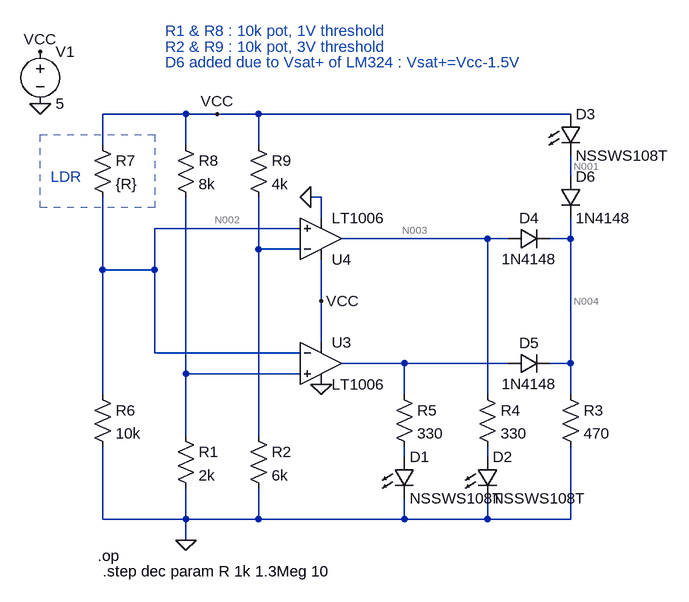
[diagram p0: schematic LDR archi.asc]
LDR archi.asc, the LTspice schematic file:
Version 4
SHEET 1 920 680
WIRE 176 -80 48 -80
WIRE 224 -80 176 -80
WIRE 288 -80 224 -80
WIRE 768 -80 288 -80
WIRE 48 -32 48 -80
WIRE 176 -32 176 -80
WIRE 288 -32 288 -80
WIRE 768 16 768 -16
WIRE 384 48 368 48
WIRE 384 80 384 48
WIRE 352 96 128 96
WIRE 640 112 416 112
WIRE 672 112 640 112
WIRE 768 112 768 80
WIRE 768 112 736 112
WIRE 288 128 288 48
WIRE 352 128 288 128
WIRE 48 160 48 48
WIRE 128 160 128 96
WIRE 128 160 48 160
WIRE 384 208 384 144
WIRE 384 272 384 208
WIRE 128 288 128 160
WIRE 352 288 128 288
WIRE 512 304 416 304
WIRE 672 304 512 304
WIRE 768 304 768 112
WIRE 768 304 736 304
WIRE 176 320 176 48
WIRE 352 320 176 320
WIRE 48 352 48 160
WIRE 512 352 512 304
WIRE 640 352 640 112
WIRE 768 352 768 304
WIRE 176 416 176 320
WIRE 288 416 288 128
WIRE 512 448 512 432
WIRE 640 448 640 432
WIRE 48 544 48 432
WIRE 176 544 176 496
WIRE 176 544 48 544
WIRE 288 544 288 496
WIRE 288 544 176 544
WIRE 512 544 512 512
WIRE 512 544 288 544
WIRE 640 544 640 512
WIRE 640 544 512 544
WIRE 768 544 768 432
WIRE 768 544 640 544
WIRE 176 576 176 544
FLAG -48 -96 0
FLAG -48 -176 VCC
FLAG 384 208 VCC
FLAG 224 -80 VCC
FLAG 384 336 0
FLAG 176 576 0
FLAG 368 48 0
SYMBOL voltage -48 -192 R0
WINDOW 123 0 0 Left 2
WINDOW 39 0 0 Left 2
SYMATTR InstName V1
SYMATTR Value 5
SYMBOL res 160 400 R0
SYMATTR InstName R1
SYMATTR Value 2k
SYMBOL res 272 400 R0
SYMATTR InstName R2
SYMATTR Value 6k
SYMBOL LED 752 -80 R0
SYMATTR InstName D3
SYMATTR Value NSSWS108T
SYMBOL res 752 336 R0
SYMATTR InstName R3
SYMATTR Value 470
SYMBOL res 624 336 R0
SYMATTR InstName R4
SYMATTR Value 330
SYMBOL res 496 336 R0
SYMATTR InstName R5
SYMATTR Value 330
SYMBOL diode 672 128 R270
WINDOW 0 32 32 VTop 2
WINDOW 3 0 32 VBottom 2
SYMATTR InstName D4
SYMATTR Value 1N4148
SYMBOL diode 672 320 R270
WINDOW 0 32 32 VTop 2
WINDOW 3 0 32 VBottom 2
SYMATTR InstName D5
SYMATTR Value 1N4148
SYMBOL res 32 336 R0
SYMATTR InstName R6
SYMATTR Value 10k
SYMBOL res 32 -48 R0
SYMATTR InstName R7
SYMATTR Value {R}
SYMBOL Opamps\\LT1006 384 240 R0
SYMATTR InstName U3
SYMBOL Opamps\\LT1006 384 176 M180
SYMATTR InstName U4
SYMBOL res 160 -48 R0
SYMATTR InstName R8
SYMATTR Value 8k
SYMBOL res 272 -48 R0
SYMATTR InstName R9
SYMATTR Value 4k
SYMBOL diode 752 16 R0
SYMATTR InstName D6
SYMATTR Value 1N4148
SYMBOL LED 496 448 R0
SYMATTR InstName D1
SYMATTR Value NSSWS108T
SYMBOL LED 624 448 R0
SYMATTR InstName D2
SYMATTR Value NSSWS108T
TEXT 40 600 Left 2 !.op
TEXT 48 624 Left 2 !.step dec param R 1k 1.3Meg 10
TEXT -32 16 Left 2 ;LDR
TEXT 144 -208 Left 2 ;R1 & R8 : 10k pot, 1V threshold
TEXT 144 -184 Left 2 ;R2 & R9 : 10k pot, 3V threshold
TEXT 144 -160 Left 2 ;D6 added due to Vsat+ of LM324 : Vsat+=Vcc-1.5V
RECTANGLE Normal 128 64 -48 -48 2

The netlist it stands for:
* LDR archi.asc
V1 VCC 0 5
R1 N007 0 2k
R2 N005 0 6k
D3 VCC N001 NSSWS108T
R3 N004 0 470
R4 N003 N009 330
R5 N006 N008 330
D4 N003 N004 1N4148
D5 N006 N004 1N4148
R6 N002 0 10k
R7 VCC N002 {R}
XU3 N007 N002 VCC 0 N006 LT1006  ; pins In+ In- V+ V- OUT
XU4 N002 N005 VCC 0 N003 LT1006  ; pins In+ In- V+ V- OUT
R8 VCC N007 8k
R9 VCC N005 4k
D6 N001 N004 1N4148
D1 N008 0 NSSWS108T
D2 N009 0 NSSWS108T
.model D D
.lib standard.dio
.op
.step dec param R 1k 1.3Meg 10
* LDR
* R1 & R8 : 10k pot, 1V threshold
* R2 & R9 : 10k pot, 3V threshold
* D6 added due to Vsat+ of LM324 : Vsat+=Vcc-1.5V
.lib LTC.lib
.backanno
.end

* Results of the author's LTspice run, read from the files saved beside the schematic
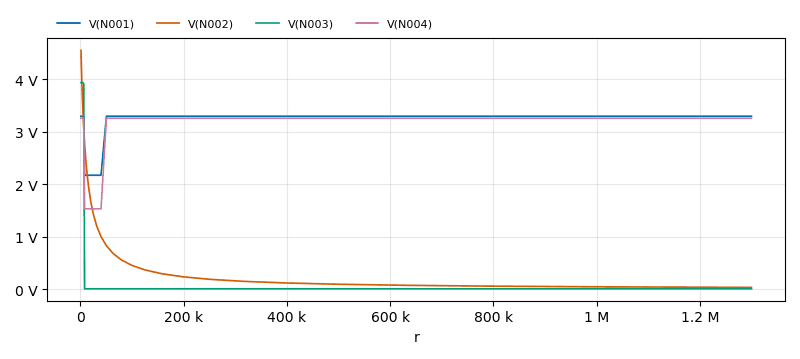
[diagram p1: Operating Point of LDR archi.asc, plotted from the saved traces]
* Operating Point, 1 run:
*   V(N001): 3.294 V at r=1 k, 3.294 V at r=1.3 M, min 2.171 V, max 3.294 V
*   V(N002): 4.545 V at r=1 k, 38.44 mV at r=1.3 M, min 38.44 mV, max 4.545 V
*   V(N003): 3.931 V at r=1 k, 11.86 mV at r=1.3 M, min 11.86 mV, max 3.931 V
*   V(N004): 3.255 V at r=1 k, 3.255 V at r=1.3 M, min 1.531 V, max 3.255 V
* From the log:
*   Semiconductor Device Operating Points:
*                           --- Diodes ---
*   Name:    d:u4:6      d:u4:1      d:u4:5      d:u4:4      d:u4:3
*   Model:    u4:yd       u4:yu       u4:xd       u4:xu     u4:dbias
*   Id:     -1.04e-12    1.04e-12   -9.35e-11    1.38e-05   -8.80e-09
*   Vd:     -5.20e-01    5.20e-01   -4.45e+00   -5.49e-01   -2.00e+00
*   Req:     1.00e-12    1.00e-12    2.00e-11    1.00e-03    1.00e+12
*   CAP:     0.00e+00    0.00e+00    0.00e+00    0.00e+00    0.00e+00
*   Name:    d:u4:2      d:u3:6      d:u3:1      d:u3:5      d:u3:4
*   Model:  u4:dbias      u3:yd       u3:yu       u3:xd       u3:xu
*   Id:     -8.80e-09    1.13e-13   -1.13e-13    1.38e-05   -1.06e-10
*   Vd:     -4.55e-01    5.64e-02   -5.64e-02    4.45e-02   -5.04e+00
*   Req:     3.71e+10    1.00e-12    1.00e-12    1.00e-03    2.00e-11
*   CAP:     0.00e+00    0.00e+00    0.00e+00    0.00e+00    0.00e+00
*   Name:    d:u3:3      d:u3:2        d6          d5          d4
*   Model:  u3:dbias    u3:dbias     1n4148      1n4148      1n4148
*   Id:     -8.80e-09   -8.80e-09    3.46e-09   -2.52e-09    6.93e-03
*   Vd:     -4.55e-01   -4.00e+00    3.92e-02   -3.24e+00    6.76e-01
*   Req:     3.71e+10    1.00e+12    7.58e+06    1.00e+12    6.54e+00
*   CAP:     0.00e+00    0.00e+00    4.07e-12    2.24e-12    3.06e-09
*   Name:      d2          d1          d3
*   Model:  nssws108t   nssws108t   nssws108t
*   Id:      3.33e-03    1.19e-14    3.46e-09
*   Vd:      2.83e+00    1.19e-02    1.71e+00
*   Req:     2.35e+01    1.00e+12    2.26e+07
*   CAP:     1.95e-10    4.23e-11    1.31e-10
*                           --- VDMOSFET Transistors ---
*   Name:        m:u4:2      m:u4:1      m:u3:2      m:u3:1
*   Model:        u4:p        u4:n        u3:p        u3:n
*   Id:         -3.94e-12    1.03e-02   -1.01e-04    1.01e-04
*   Vgs:         5.20e-01    5.20e-01   -5.64e-02   -5.64e-02
*   Vds:        -3.93e+00    1.07e+00   -1.19e-02    4.99e+00
*   Vth:         1.20e-01   -1.20e-01    1.20e-01   -1.20e-01
*   Gm:          0.00e+00    3.20e-02    5.93e-04    3.18e-03
*   Gds:         0.00e+00    0.00e+00    8.23e-03    0.00e+00
*   Cgs:         0.00e+00    0.00e+00    0.00e+00    0.00e+00
*   Cgd:         0.00e+00    0.00e+00    0.00e+00    0.00e+00
*   Cbody:       0.00e+00    0.00e+00    0.00e+00    0.00e+00